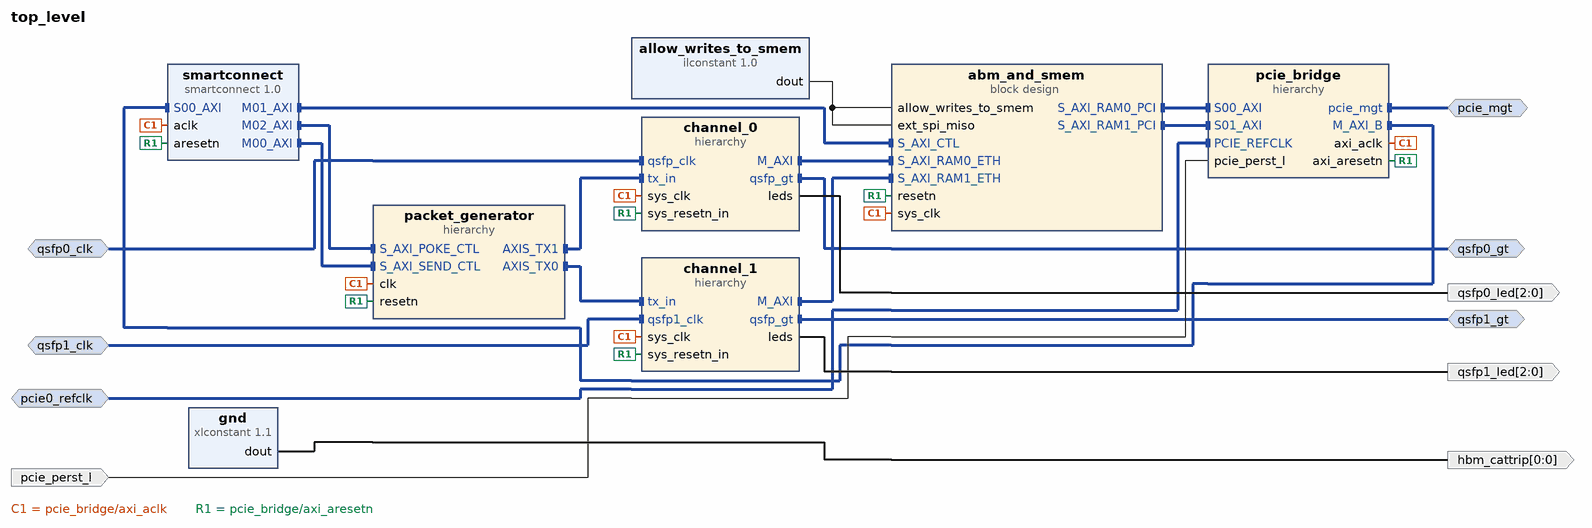
[diagram p0: block diagram of the top level]
# Vivado block design top_level, xcu55c-fsvh2892-2L-e, Vivado 2024.2
create_bd_design top_level

create_bd_intf_port -mode Slave -vlnv xilinx.com:interface:diff_clock_rtl:1.0 pcie0_refclk
create_bd_intf_port -mode Master -vlnv xilinx.com:interface:pcie_7x_mgt_rtl:1.0 pcie_mgt
create_bd_intf_port -mode Master -vlnv xilinx.com:interface:gt_rtl:1.0 qsfp0_gt
create_bd_intf_port -mode Slave -vlnv xilinx.com:interface:diff_clock_rtl:1.0 qsfp0_clk
set_property -dict {CONFIG.FREQ_HZ 161132812} [get_bd_intf_ports qsfp0_clk]
create_bd_intf_port -mode Master -vlnv xilinx.com:interface:gt_rtl:1.0 qsfp1_gt
create_bd_intf_port -mode Slave -vlnv xilinx.com:interface:diff_clock_rtl:1.0 qsfp1_clk
set_property -dict {CONFIG.FREQ_HZ 161132812} [get_bd_intf_ports qsfp1_clk]
create_bd_port -dir O -from 0 -to 0 hbm_cattrip
create_bd_port -dir I -type rst pcie_perst_l
create_bd_port -dir O -from 2 -to 0 qsfp1_led
create_bd_port -dir O -from 2 -to 0 qsfp0_led

create_bd_cell -type hier pcie_bridge
create_bd_cell -type ip -vlnv xilinx.com:ip:smartconnect:1.0 smartconnect
set_property -dict {CONFIG.NUM_MI 3 CONFIG.NUM_SI 1} [get_bd_cells smartconnect]
create_bd_cell -type ip -vlnv xilinx.com:ip:xlconstant:1.1 gnd
set_property -dict {CONFIG.CONST_VAL 0} [get_bd_cells gnd]
create_bd_cell -type hier channel_0
create_bd_cell -type hier channel_1
create_bd_cell -type hier packet_generator
create_bd_cell -type inline_hdl -vlnv xilinx.com:inline_hdl:ilconstant:1.0 allow_writes_to_smem
create_bd_cell -type container -reference abm_and_smem abm_and_smem
set_property -dict [list \
  CONFIG.ACTIVE_SIM_BD abm_and_smem.bd \
  CONFIG.ACTIVE_SYNTH_BD abm_and_smem.bd \
  CONFIG.ENABLE_DFX 0 \
  CONFIG.LIST_SIM_BD abm_and_smem.bd \
  CONFIG.LIST_SYNTH_BD abm_and_smem.bd \
  CONFIG.LOCK_PROPAGATE 0 \
] [get_bd_cells abm_and_smem]

# ---- hierarchy /pcie_bridge ----
current_bd_instance /pcie_bridge
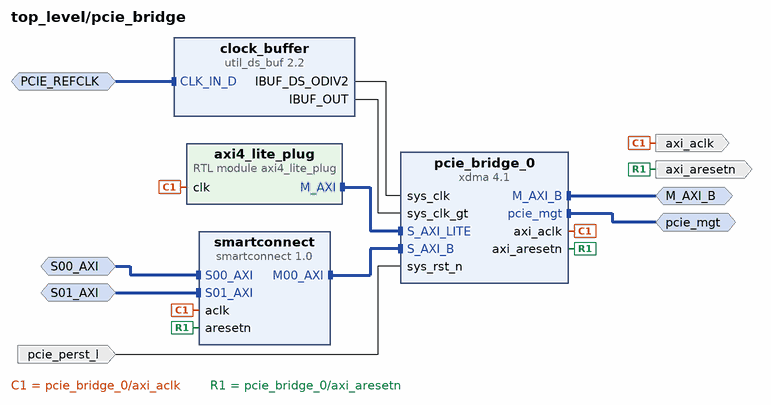
[diagram p1: block diagram inside /pcie_bridge]
create_bd_intf_pin -mode Slave -vlnv xilinx.com:interface:diff_clock_rtl:1.0 PCIE_REFCLK
create_bd_intf_pin -mode Slave -vlnv xilinx.com:interface:aximm_rtl:1.0 S00_AXI
create_bd_intf_pin -mode Slave -vlnv xilinx.com:interface:aximm_rtl:1.0 S01_AXI
create_bd_intf_pin -mode Master -vlnv xilinx.com:interface:pcie_7x_mgt_rtl:1.0 pcie_mgt
create_bd_intf_pin -mode Master -vlnv xilinx.com:interface:aximm_rtl:1.0 M_AXI_B
create_bd_pin -dir I -type rst pcie_perst_l
create_bd_pin -dir O -type clk axi_aclk
create_bd_pin -dir O -type rst axi_aresetn

create_bd_cell -type ip -vlnv xilinx.com:ip:util_ds_buf:2.2 clock_buffer
set_property -dict {CONFIG.C_BUF_TYPE IBUFDSGTE} [get_bd_cells clock_buffer]
create_bd_cell -type ip -vlnv xilinx.com:ip:smartconnect:1.0 smartconnect
set_property -dict {CONFIG.NUM_MI 1} [get_bd_cells smartconnect]
create_bd_cell -type module -reference axi4_lite_plug axi4_lite_plug
create_bd_cell -type ip -vlnv xilinx.com:ip:xdma:4.1 pcie_bridge_0
set_property -dict [list \
  CONFIG.PF0_DEVICE_ID_mqdma 9048 \
  CONFIG.PF0_SRIOV_VF_DEVICE_ID A048 \
  CONFIG.PF2_DEVICE_ID_mqdma 9248 \
  CONFIG.PF3_DEVICE_ID_mqdma 9348 \
  CONFIG.axi_addr_width 64 \
  CONFIG.axi_data_width 512_bit \
  CONFIG.axisten_freq 250 \
  CONFIG.bridge_burst true \
  CONFIG.en_axi_slave_if true \
  CONFIG.en_gt_selection false \
  CONFIG.functional_mode AXI_Bridge \
  CONFIG.mode_selection Advanced \
  CONFIG.pcie_blk_locn PCIE4C_X1Y0 \
  CONFIG.pf0_bar0_scale Megabytes \
  CONFIG.pf0_bar0_size 1 \
  CONFIG.pf0_device_id 903F \
  CONFIG.pf0_msi_enabled false \
  CONFIG.pl_link_cap_max_link_speed 16.0_GT/s \
  CONFIG.pl_link_cap_max_link_width X8 \
  CONFIG.runbit_fix false \
  CONFIG.xlnx_ref_board None \
] [get_bd_cells pcie_bridge_0]

# ---- hierarchy /channel_0 ----
current_bd_instance /channel_0
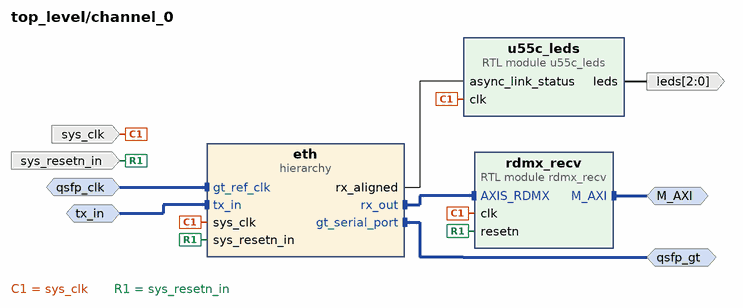
[diagram p2: block diagram inside /channel_0]
create_bd_intf_pin -mode Master -vlnv xilinx.com:interface:gt_rtl:1.0 qsfp_gt
create_bd_intf_pin -mode Slave -vlnv xilinx.com:interface:diff_clock_rtl:1.0 qsfp_clk
create_bd_intf_pin -mode Slave -vlnv xilinx.com:interface:axis_rtl:1.0 tx_in
create_bd_intf_pin -mode Master -vlnv xilinx.com:interface:aximm_rtl:1.0 M_AXI
create_bd_pin -dir I sys_clk
create_bd_pin -dir I sys_resetn_in
create_bd_pin -dir O -from 2 -to 0 leds

create_bd_cell -type hier eth
create_bd_cell -type module -reference u55c_leds u55c_leds
create_bd_cell -type module -reference rdmx_recv rdmx_recv

# ---- hierarchy /channel_0/eth ----
current_bd_instance /channel_0/eth
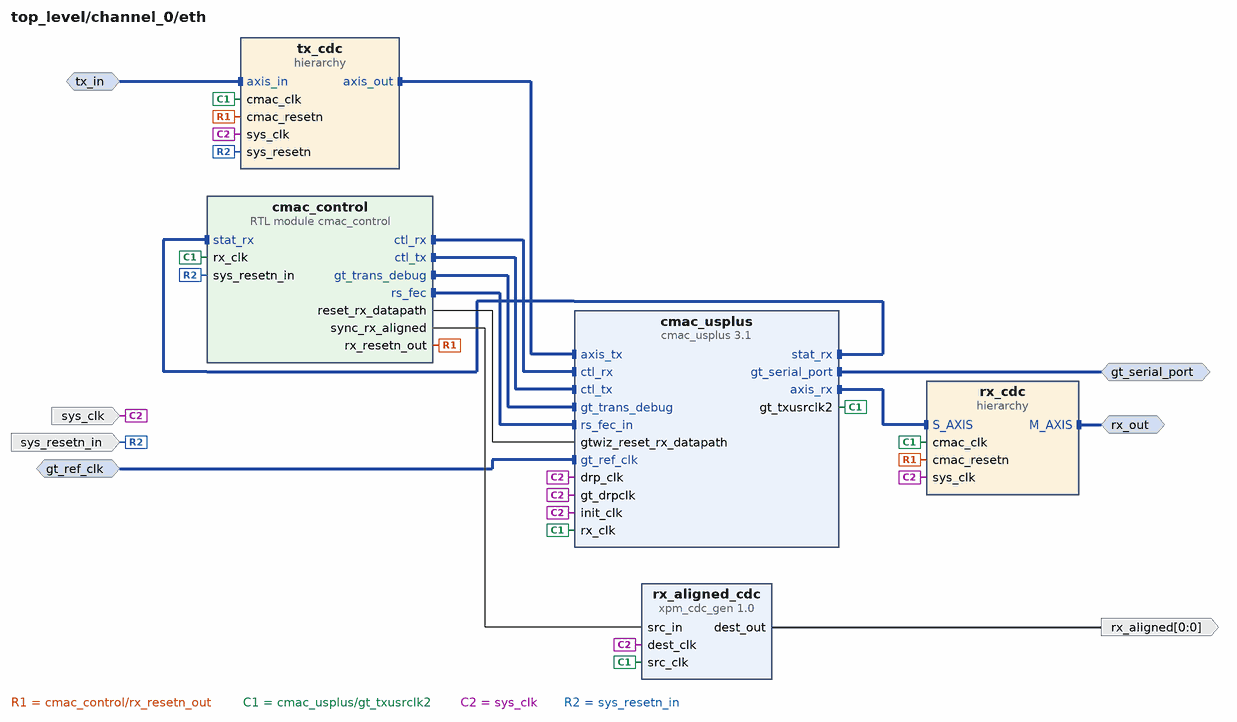
[diagram p3: block diagram inside /channel_0/eth]
create_bd_intf_pin -mode Master -vlnv xilinx.com:interface:gt_rtl:1.0 gt_serial_port
create_bd_intf_pin -mode Slave -vlnv xilinx.com:interface:diff_clock_rtl:1.0 gt_ref_clk
create_bd_intf_pin -mode Master -vlnv xilinx.com:interface:axis_rtl:1.0 rx_out
create_bd_intf_pin -mode Slave -vlnv xilinx.com:interface:axis_rtl:1.0 tx_in
create_bd_pin -dir I sys_resetn_in
create_bd_pin -dir I sys_clk
create_bd_pin -dir O -from 0 -to 0 rx_aligned

create_bd_cell -type ip -vlnv xilinx.com:ip:cmac_usplus:3.1 cmac_usplus
set_property -dict [list \
  CONFIG.ADD_GT_CNRL_STS_PORTS 1 \
  CONFIG.CMAC_CAUI4_MODE 1 \
  CONFIG.CMAC_CORE_SELECT CMACE4_X0Y3 \
  CONFIG.DIFFCLK_BOARD_INTERFACE Custom \
  CONFIG.ETHERNET_BOARD_INTERFACE Custom \
  CONFIG.GT_DRP_CLK 250 \
  CONFIG.GT_GROUP_SELECT {X0Y24~X0Y27} \
  CONFIG.GT_REF_CLK_FREQ 161.1328125 \
  CONFIG.INCLUDE_RS_FEC 1 \
  CONFIG.NUM_LANES 4x25 \
  CONFIG.RX_FLOW_CONTROL 0 \
  CONFIG.RX_GT_BUFFER 1 \
  CONFIG.TX_FLOW_CONTROL 0 \
  CONFIG.USER_INTERFACE AXIS \
] [get_bd_cells cmac_usplus]
create_bd_cell -type module -reference cmac_control cmac_control
create_bd_cell -type ip -vlnv xilinx.com:ip:xpm_cdc_gen:1.0 rx_aligned_cdc
set_property -dict [list \
  CONFIG.CDC_TYPE xpm_cdc_single \
  CONFIG.SIM_ASSERT_CHK false \
  CONFIG.SRC_INPUT_REG false \
  CONFIG.WIDTH 1 \
] [get_bd_cells rx_aligned_cdc]
create_bd_cell -type hier tx_cdc
create_bd_cell -type hier rx_cdc

# ---- hierarchy /channel_0/eth/tx_cdc ----
current_bd_instance /channel_0/eth/tx_cdc
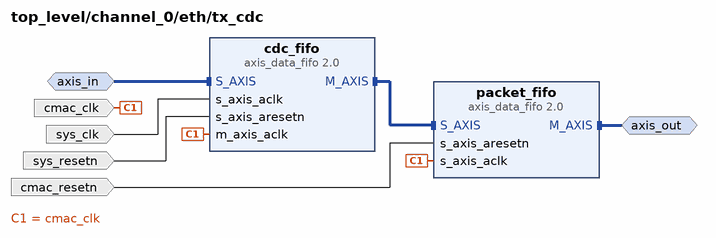
[diagram p4: block diagram inside /channel_0/eth/tx_cdc]
create_bd_intf_pin -mode Slave -vlnv xilinx.com:interface:axis_rtl:1.0 axis_in
create_bd_intf_pin -mode Master -vlnv xilinx.com:interface:axis_rtl:1.0 axis_out
create_bd_pin -dir I sys_clk
create_bd_pin -dir I sys_resetn
create_bd_pin -dir I cmac_clk
create_bd_pin -dir I cmac_resetn

create_bd_cell -type ip -vlnv xilinx.com:ip:axis_data_fifo:2.0 cdc_fifo
set_property -dict {CONFIG.FIFO_DEPTH 16 CONFIG.IS_ACLK_ASYNC 1} [get_bd_cells cdc_fifo]
create_bd_cell -type ip -vlnv xilinx.com:ip:axis_data_fifo:2.0 packet_fifo
set_property -dict {CONFIG.FIFO_MODE 2 CONFIG.IS_ACLK_ASYNC 0} [get_bd_cells packet_fifo]

# ---- hierarchy /channel_0/eth/rx_cdc ----
current_bd_instance /channel_0/eth/rx_cdc
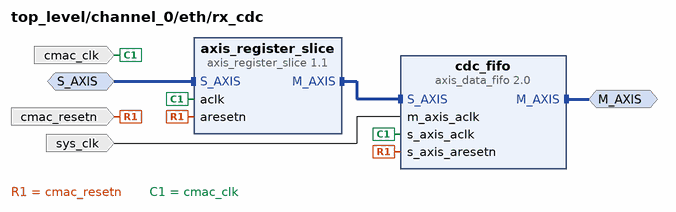
[diagram p5: block diagram inside /channel_0/eth/rx_cdc]
create_bd_intf_pin -mode Slave -vlnv xilinx.com:interface:axis_rtl:1.0 S_AXIS
create_bd_intf_pin -mode Master -vlnv xilinx.com:interface:axis_rtl:1.0 M_AXIS
create_bd_pin -dir I -type rst cmac_resetn
create_bd_pin -dir I -type clk cmac_clk
create_bd_pin -dir I sys_clk

create_bd_cell -type ip -vlnv xilinx.com:ip:axis_data_fifo:2.0 cdc_fifo
set_property -dict {CONFIG.FIFO_DEPTH 16 CONFIG.IS_ACLK_ASYNC 1} [get_bd_cells cdc_fifo]
create_bd_cell -type ip -vlnv xilinx.com:ip:axis_register_slice:1.1 axis_register_slice

# ---- hierarchy /channel_1 ----
current_bd_instance /channel_1
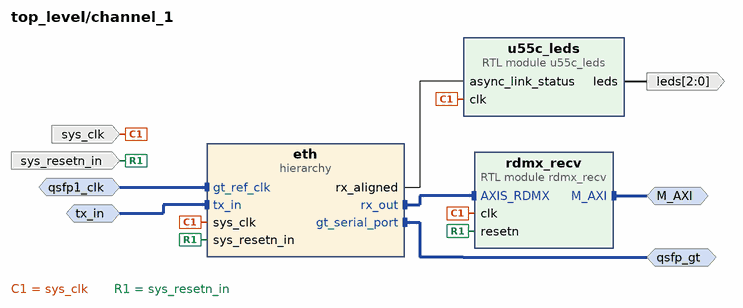
[diagram p6: block diagram inside /channel_1]
create_bd_intf_pin -mode Master -vlnv xilinx.com:interface:gt_rtl:1.0 qsfp_gt
create_bd_intf_pin -mode Slave -vlnv xilinx.com:interface:diff_clock_rtl:1.0 qsfp1_clk
create_bd_intf_pin -mode Slave -vlnv xilinx.com:interface:axis_rtl:1.0 tx_in
create_bd_intf_pin -mode Master -vlnv xilinx.com:interface:aximm_rtl:1.0 M_AXI
create_bd_pin -dir I sys_clk
create_bd_pin -dir I sys_resetn_in
create_bd_pin -dir O -from 2 -to 0 leds

create_bd_cell -type hier eth
create_bd_cell -type module -reference u55c_leds u55c_leds
create_bd_cell -type module -reference rdmx_recv rdmx_recv

# ---- hierarchy /channel_1/eth ----
current_bd_instance /channel_1/eth
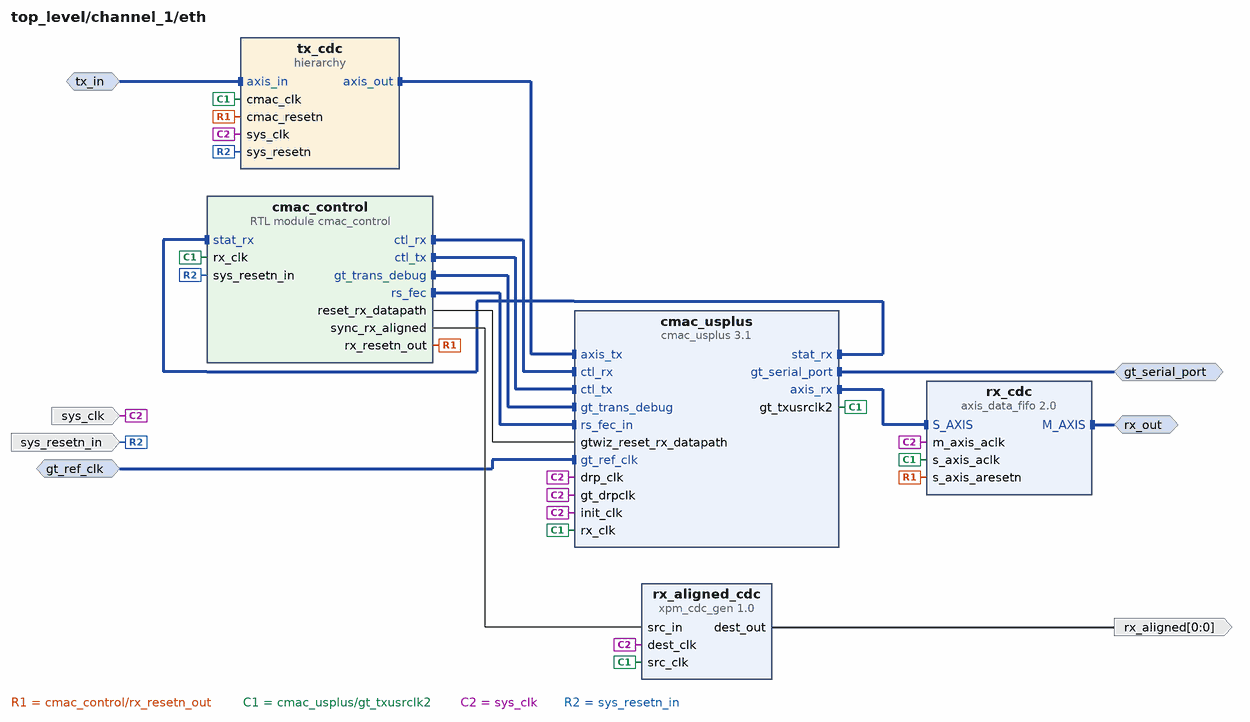
[diagram p7: block diagram inside /channel_1/eth]
create_bd_intf_pin -mode Master -vlnv xilinx.com:interface:gt_rtl:1.0 gt_serial_port
create_bd_intf_pin -mode Slave -vlnv xilinx.com:interface:diff_clock_rtl:1.0 gt_ref_clk
create_bd_intf_pin -mode Master -vlnv xilinx.com:interface:axis_rtl:1.0 rx_out
create_bd_intf_pin -mode Slave -vlnv xilinx.com:interface:axis_rtl:1.0 tx_in
create_bd_pin -dir I sys_resetn_in
create_bd_pin -dir I sys_clk
create_bd_pin -dir O -from 0 -to 0 rx_aligned

create_bd_cell -type ip -vlnv xilinx.com:ip:cmac_usplus:3.1 cmac_usplus
set_property -dict [list \
  CONFIG.ADD_GT_CNRL_STS_PORTS 1 \
  CONFIG.CMAC_CAUI4_MODE 1 \
  CONFIG.CMAC_CORE_SELECT CMACE4_X0Y4 \
  CONFIG.DIFFCLK_BOARD_INTERFACE Custom \
  CONFIG.ETHERNET_BOARD_INTERFACE Custom \
  CONFIG.GT_DRP_CLK 250 \
  CONFIG.GT_GROUP_SELECT {X0Y28~X0Y31} \
  CONFIG.GT_REF_CLK_FREQ 161.1328125 \
  CONFIG.INCLUDE_RS_FEC 1 \
  CONFIG.NUM_LANES 4x25 \
  CONFIG.RX_FLOW_CONTROL 0 \
  CONFIG.RX_GT_BUFFER 1 \
  CONFIG.TX_FLOW_CONTROL 0 \
  CONFIG.USER_INTERFACE AXIS \
] [get_bd_cells cmac_usplus]
create_bd_cell -type module -reference cmac_control cmac_control
create_bd_cell -type ip -vlnv xilinx.com:ip:axis_data_fifo:2.0 rx_cdc
set_property -dict {CONFIG.FIFO_DEPTH 16 CONFIG.IS_ACLK_ASYNC 1} [get_bd_cells rx_cdc]
create_bd_cell -type ip -vlnv xilinx.com:ip:xpm_cdc_gen:1.0 rx_aligned_cdc
set_property -dict [list \
  CONFIG.CDC_TYPE xpm_cdc_single \
  CONFIG.SIM_ASSERT_CHK false \
  CONFIG.SRC_INPUT_REG false \
  CONFIG.WIDTH 1 \
] [get_bd_cells rx_aligned_cdc]
create_bd_cell -type hier tx_cdc

# ---- hierarchy /channel_1/eth/tx_cdc ----
current_bd_instance /channel_1/eth/tx_cdc
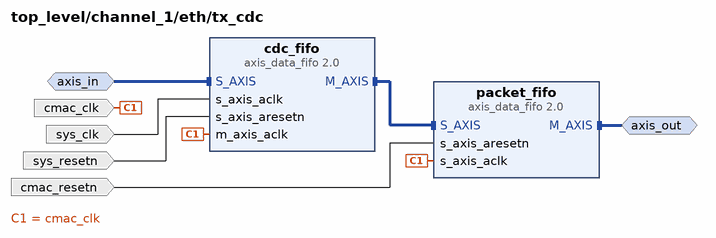
[diagram p8: block diagram inside /channel_1/eth/tx_cdc]
create_bd_intf_pin -mode Slave -vlnv xilinx.com:interface:axis_rtl:1.0 axis_in
create_bd_intf_pin -mode Master -vlnv xilinx.com:interface:axis_rtl:1.0 axis_out
create_bd_pin -dir I sys_clk
create_bd_pin -dir I sys_resetn
create_bd_pin -dir I cmac_clk
create_bd_pin -dir I cmac_resetn

create_bd_cell -type ip -vlnv xilinx.com:ip:axis_data_fifo:2.0 cdc_fifo
set_property -dict {CONFIG.FIFO_DEPTH 16 CONFIG.IS_ACLK_ASYNC 1} [get_bd_cells cdc_fifo]
create_bd_cell -type ip -vlnv xilinx.com:ip:axis_data_fifo:2.0 packet_fifo
set_property -dict {CONFIG.FIFO_MODE 2 CONFIG.IS_ACLK_ASYNC 0} [get_bd_cells packet_fifo]

# ---- hierarchy /packet_generator ----
current_bd_instance /packet_generator
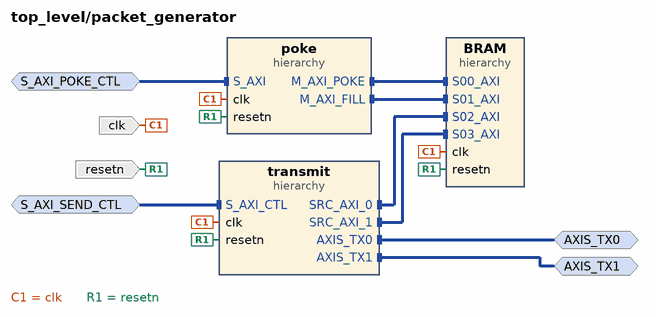
[diagram p9: block diagram inside /packet_generator]
create_bd_intf_pin -mode Slave -vlnv xilinx.com:interface:aximm_rtl:1.0 S_AXI_POKE_CTL
create_bd_intf_pin -mode Slave -vlnv xilinx.com:interface:aximm_rtl:1.0 S_AXI_SEND_CTL
create_bd_intf_pin -mode Master -vlnv xilinx.com:interface:axis_rtl:1.0 AXIS_TX0
create_bd_intf_pin -mode Master -vlnv xilinx.com:interface:axis_rtl:1.0 AXIS_TX1
create_bd_pin -dir I clk
create_bd_pin -dir I resetn

create_bd_cell -type hier poke
create_bd_cell -type hier transmit
create_bd_cell -type hier BRAM

# ---- hierarchy /packet_generator/poke ----
current_bd_instance /packet_generator/poke
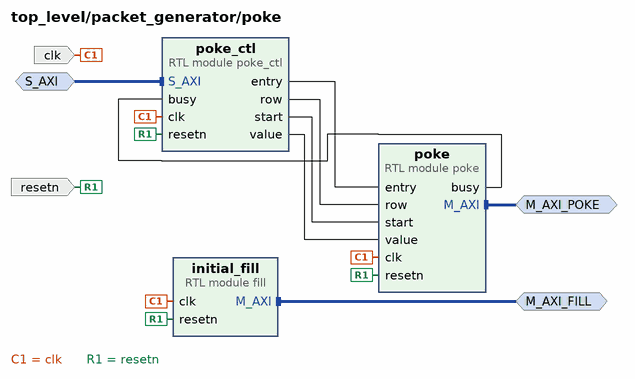
[diagram p10: block diagram inside /packet_generator/poke]
create_bd_intf_pin -mode Slave -vlnv xilinx.com:interface:aximm_rtl:1.0 S_AXI
create_bd_intf_pin -mode Master -vlnv xilinx.com:interface:aximm_rtl:1.0 M_AXI_POKE
create_bd_intf_pin -mode Master -vlnv xilinx.com:interface:aximm_rtl:1.0 M_AXI_FILL
create_bd_pin -dir I clk
create_bd_pin -dir I resetn

create_bd_cell -type module -reference poke_ctl poke_ctl
create_bd_cell -type module -reference poke poke
create_bd_cell -type module -reference fill initial_fill

# ---- hierarchy /packet_generator/transmit ----
current_bd_instance /packet_generator/transmit
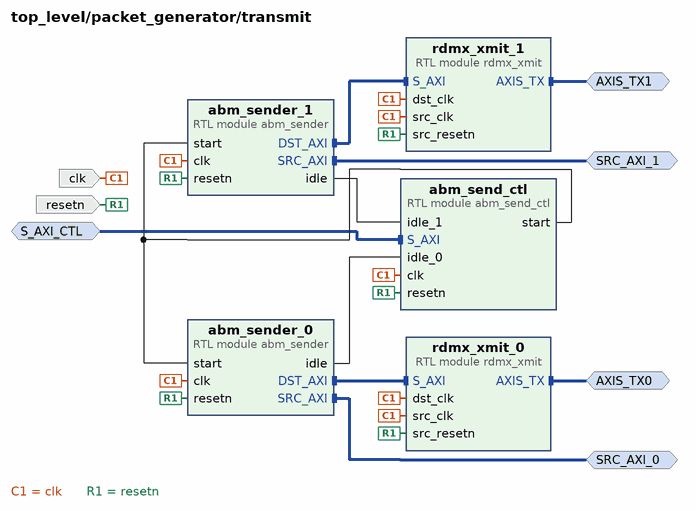
[diagram p11: block diagram inside /packet_generator/transmit]
create_bd_intf_pin -mode Master -vlnv xilinx.com:interface:aximm_rtl:1.0 SRC_AXI_0
create_bd_intf_pin -mode Master -vlnv xilinx.com:interface:axis_rtl:1.0 AXIS_TX0
create_bd_intf_pin -mode Master -vlnv xilinx.com:interface:axis_rtl:1.0 AXIS_TX1
create_bd_intf_pin -mode Master -vlnv xilinx.com:interface:aximm_rtl:1.0 SRC_AXI_1
create_bd_intf_pin -mode Slave -vlnv xilinx.com:interface:aximm_rtl:1.0 S_AXI_CTL
create_bd_pin -dir I clk
create_bd_pin -dir I resetn

create_bd_cell -type module -reference abm_sender abm_sender_0
create_bd_cell -type module -reference rdmx_xmit rdmx_xmit_0
set_property -dict {CONFIG.FIFO_CLOCK_MODE common_clk CONFIG.SRC_MAC 0} [get_bd_cells rdmx_xmit_0]
create_bd_cell -type module -reference rdmx_xmit rdmx_xmit_1
set_property -dict {CONFIG.FIFO_CLOCK_MODE common_clk CONFIG.SRC_MAC 1} [get_bd_cells rdmx_xmit_1]
create_bd_cell -type module -reference abm_sender abm_sender_1
create_bd_cell -type module -reference abm_send_ctl abm_send_ctl

# ---- hierarchy /packet_generator/BRAM ----
current_bd_instance /packet_generator/BRAM
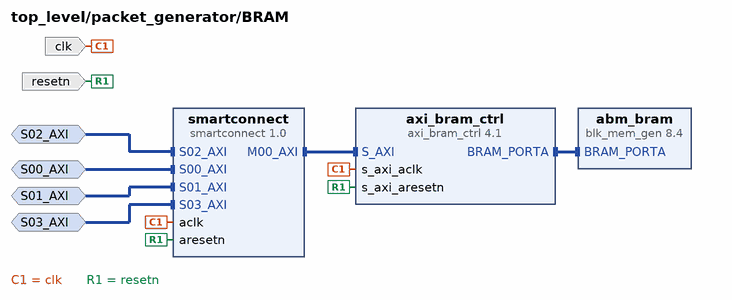
[diagram p12: block diagram inside /packet_generator/BRAM]
create_bd_intf_pin -mode Slave -vlnv xilinx.com:interface:aximm_rtl:1.0 S00_AXI
create_bd_intf_pin -mode Slave -vlnv xilinx.com:interface:aximm_rtl:1.0 S01_AXI
create_bd_intf_pin -mode Slave -vlnv xilinx.com:interface:aximm_rtl:1.0 S02_AXI
create_bd_intf_pin -mode Slave -vlnv xilinx.com:interface:aximm_rtl:1.0 S03_AXI
create_bd_pin -dir I clk
create_bd_pin -dir I resetn

create_bd_cell -type ip -vlnv xilinx.com:ip:smartconnect:1.0 smartconnect
set_property -dict {CONFIG.NUM_SI 4} [get_bd_cells smartconnect]
create_bd_cell -type ip -vlnv xilinx.com:ip:axi_bram_ctrl:4.1 axi_bram_ctrl
set_property -dict {CONFIG.DATA_WIDTH 512 CONFIG.SINGLE_PORT_BRAM 1 CONFIG.SUPPORTS_NARROW_BURST 0} [get_bd_cells axi_bram_ctrl]
create_bd_cell -type ip -vlnv xilinx.com:ip:blk_mem_gen:8.4 abm_bram
set_property -dict {CONFIG.PRIM_type_to_Implement URAM} [get_bd_cells abm_bram]

# ---- connections ----

current_bd_instance /pcie_bridge
connect_bd_intf_net [get_bd_intf_pins PCIE_REFCLK] [get_bd_intf_pins clock_buffer/CLK_IN_D]
connect_bd_intf_net [get_bd_intf_pins pcie_bridge_0/pcie_mgt] [get_bd_intf_pins pcie_mgt]
connect_bd_intf_net [get_bd_intf_pins pcie_bridge_0/M_AXI_B] [get_bd_intf_pins M_AXI_B]
connect_bd_intf_net [get_bd_intf_pins S00_AXI] [get_bd_intf_pins smartconnect/S00_AXI]
connect_bd_intf_net [get_bd_intf_pins S01_AXI] [get_bd_intf_pins smartconnect/S01_AXI]
connect_bd_intf_net [get_bd_intf_pins axi4_lite_plug/M_AXI] [get_bd_intf_pins pcie_bridge_0/S_AXI_LITE]
connect_bd_intf_net [get_bd_intf_pins smartconnect/M00_AXI] [get_bd_intf_pins pcie_bridge_0/S_AXI_B]
connect_bd_net [get_bd_pins clock_buffer/IBUF_DS_ODIV2] [get_bd_pins pcie_bridge_0/sys_clk]
connect_bd_net [get_bd_pins clock_buffer/IBUF_OUT] [get_bd_pins pcie_bridge_0/sys_clk_gt]
connect_bd_net [get_bd_pins pcie_bridge_0/axi_aclk] [get_bd_pins axi_aclk] [get_bd_pins smartconnect/aclk] [get_bd_pins axi4_lite_plug/clk]
connect_bd_net [get_bd_pins pcie_bridge_0/axi_aresetn] [get_bd_pins axi_aresetn] [get_bd_pins smartconnect/aresetn]
connect_bd_net [get_bd_pins pcie_perst_l] [get_bd_pins pcie_bridge_0/sys_rst_n]

current_bd_instance /channel_0
connect_bd_intf_net [get_bd_intf_pins qsfp_gt] [get_bd_intf_pins eth/gt_serial_port]
connect_bd_intf_net [get_bd_intf_pins eth/rx_out] [get_bd_intf_pins rdmx_recv/AXIS_RDMX]
connect_bd_intf_net [get_bd_intf_pins qsfp_clk] [get_bd_intf_pins eth/gt_ref_clk]
connect_bd_intf_net [get_bd_intf_pins M_AXI] [get_bd_intf_pins rdmx_recv/M_AXI]
connect_bd_intf_net [get_bd_intf_pins tx_in] [get_bd_intf_pins eth/tx_in]
connect_bd_net [get_bd_pins eth/rx_aligned] [get_bd_pins u55c_leds/async_link_status]
connect_bd_net -net pcie_bridge_0_axi_aclk [get_bd_pins sys_clk] [get_bd_pins eth/sys_clk] [get_bd_pins u55c_leds/clk] [get_bd_pins rdmx_recv/clk]
connect_bd_net -net pcie_bridge_0_axi_aresetn [get_bd_pins sys_resetn_in] [get_bd_pins eth/sys_resetn_in] [get_bd_pins rdmx_recv/resetn]
connect_bd_net -net u55c_leds_0_leds [get_bd_pins u55c_leds/leds] [get_bd_pins leds]

current_bd_instance /channel_0/eth
connect_bd_intf_net [get_bd_intf_pins rx_out] [get_bd_intf_pins rx_cdc/M_AXIS]
connect_bd_intf_net [get_bd_intf_pins cmac_control/ctl_rx] [get_bd_intf_pins cmac_usplus/ctl_rx]
connect_bd_intf_net [get_bd_intf_pins cmac_control/ctl_tx] [get_bd_intf_pins cmac_usplus/ctl_tx]
connect_bd_intf_net [get_bd_intf_pins cmac_control/gt_trans_debug] [get_bd_intf_pins cmac_usplus/gt_trans_debug]
connect_bd_intf_net [get_bd_intf_pins cmac_control/rs_fec] [get_bd_intf_pins cmac_usplus/rs_fec_in]
connect_bd_intf_net [get_bd_intf_pins cmac_usplus/axis_rx] [get_bd_intf_pins rx_cdc/S_AXIS]
connect_bd_intf_net [get_bd_intf_pins gt_serial_port] [get_bd_intf_pins cmac_usplus/gt_serial_port]
connect_bd_intf_net [get_bd_intf_pins cmac_control/stat_rx] [get_bd_intf_pins cmac_usplus/stat_rx]
connect_bd_intf_net [get_bd_intf_pins gt_ref_clk] [get_bd_intf_pins cmac_usplus/gt_ref_clk]
connect_bd_intf_net [get_bd_intf_pins tx_cdc/axis_out] [get_bd_intf_pins cmac_usplus/axis_tx]
connect_bd_intf_net [get_bd_intf_pins tx_in] [get_bd_intf_pins tx_cdc/axis_in]
connect_bd_net [get_bd_pins cmac_control/reset_rx_datapath] [get_bd_pins cmac_usplus/gtwiz_reset_rx_datapath]
connect_bd_net [get_bd_pins cmac_control/rx_resetn_out] [get_bd_pins tx_cdc/cmac_resetn] [get_bd_pins rx_cdc/cmac_resetn]
connect_bd_net [get_bd_pins cmac_control/sync_rx_aligned] [get_bd_pins rx_aligned_cdc/src_in]
connect_bd_net [get_bd_pins cmac_usplus/gt_txusrclk2] \
  [get_bd_pins cmac_control/rx_clk] [get_bd_pins tx_cdc/cmac_clk] [get_bd_pins rx_cdc/cmac_clk] \
  [get_bd_pins cmac_usplus/rx_clk] [get_bd_pins rx_aligned_cdc/src_clk]
connect_bd_net [get_bd_pins rx_aligned_cdc/dest_out] [get_bd_pins rx_aligned]
connect_bd_net [get_bd_pins sys_clk] \
  [get_bd_pins tx_cdc/sys_clk] [get_bd_pins rx_cdc/sys_clk] [get_bd_pins cmac_usplus/gt_drpclk] \
  [get_bd_pins cmac_usplus/init_clk] [get_bd_pins cmac_usplus/drp_clk] [get_bd_pins rx_aligned_cdc/dest_clk]
connect_bd_net [get_bd_pins sys_resetn_in] [get_bd_pins cmac_control/sys_resetn_in] [get_bd_pins tx_cdc/sys_resetn]

current_bd_instance /channel_0/eth/tx_cdc
connect_bd_intf_net [get_bd_intf_pins axis_in] [get_bd_intf_pins cdc_fifo/S_AXIS]
connect_bd_intf_net [get_bd_intf_pins cdc_fifo/M_AXIS] [get_bd_intf_pins packet_fifo/S_AXIS]
connect_bd_intf_net [get_bd_intf_pins axis_out] [get_bd_intf_pins packet_fifo/M_AXIS]
connect_bd_net [get_bd_pins cmac_clk] [get_bd_pins cdc_fifo/m_axis_aclk] [get_bd_pins packet_fifo/s_axis_aclk]
connect_bd_net [get_bd_pins cmac_resetn] [get_bd_pins packet_fifo/s_axis_aresetn]
connect_bd_net [get_bd_pins sys_clk] [get_bd_pins cdc_fifo/s_axis_aclk]
connect_bd_net [get_bd_pins sys_resetn] [get_bd_pins cdc_fifo/s_axis_aresetn]

current_bd_instance /channel_0/eth/rx_cdc
connect_bd_intf_net [get_bd_intf_pins S_AXIS] [get_bd_intf_pins axis_register_slice/S_AXIS]
connect_bd_intf_net [get_bd_intf_pins M_AXIS] [get_bd_intf_pins cdc_fifo/M_AXIS]
connect_bd_intf_net [get_bd_intf_pins axis_register_slice/M_AXIS] [get_bd_intf_pins cdc_fifo/S_AXIS]
connect_bd_net -net cmac_control_rx_resetn_out [get_bd_pins cmac_resetn] \
  [get_bd_pins cdc_fifo/s_axis_aresetn] [get_bd_pins axis_register_slice/aresetn]
connect_bd_net -net cmac_usplus_gt_txusrclk2 [get_bd_pins cmac_clk] [get_bd_pins cdc_fifo/s_axis_aclk] [get_bd_pins axis_register_slice/aclk]
connect_bd_net [get_bd_pins sys_clk] [get_bd_pins cdc_fifo/m_axis_aclk]

current_bd_instance /channel_1
connect_bd_intf_net [get_bd_intf_pins qsfp_gt] [get_bd_intf_pins eth/gt_serial_port]
connect_bd_intf_net [get_bd_intf_pins rdmx_recv/AXIS_RDMX] [get_bd_intf_pins eth/rx_out]
connect_bd_intf_net [get_bd_intf_pins qsfp1_clk] [get_bd_intf_pins eth/gt_ref_clk]
connect_bd_intf_net [get_bd_intf_pins M_AXI] [get_bd_intf_pins rdmx_recv/M_AXI]
connect_bd_intf_net [get_bd_intf_pins tx_in] [get_bd_intf_pins eth/tx_in]
connect_bd_net [get_bd_pins eth/rx_aligned] [get_bd_pins u55c_leds/async_link_status]
connect_bd_net -net pcie_bridge_0_axi_aclk [get_bd_pins sys_clk] [get_bd_pins eth/sys_clk] [get_bd_pins u55c_leds/clk] [get_bd_pins rdmx_recv/clk]
connect_bd_net -net pcie_bridge_0_axi_aresetn [get_bd_pins sys_resetn_in] [get_bd_pins eth/sys_resetn_in] [get_bd_pins rdmx_recv/resetn]
connect_bd_net -net u55c_leds_0_leds [get_bd_pins u55c_leds/leds] [get_bd_pins leds]

current_bd_instance /channel_1/eth
connect_bd_intf_net [get_bd_intf_pins rx_out] [get_bd_intf_pins rx_cdc/M_AXIS]
connect_bd_intf_net [get_bd_intf_pins cmac_control/ctl_rx] [get_bd_intf_pins cmac_usplus/ctl_rx]
connect_bd_intf_net [get_bd_intf_pins cmac_control/ctl_tx] [get_bd_intf_pins cmac_usplus/ctl_tx]
connect_bd_intf_net [get_bd_intf_pins cmac_control/gt_trans_debug] [get_bd_intf_pins cmac_usplus/gt_trans_debug]
connect_bd_intf_net [get_bd_intf_pins cmac_control/rs_fec] [get_bd_intf_pins cmac_usplus/rs_fec_in]
connect_bd_intf_net [get_bd_intf_pins cmac_usplus/axis_rx] [get_bd_intf_pins rx_cdc/S_AXIS]
connect_bd_intf_net [get_bd_intf_pins gt_serial_port] [get_bd_intf_pins cmac_usplus/gt_serial_port]
connect_bd_intf_net [get_bd_intf_pins cmac_control/stat_rx] [get_bd_intf_pins cmac_usplus/stat_rx]
connect_bd_intf_net [get_bd_intf_pins gt_ref_clk] [get_bd_intf_pins cmac_usplus/gt_ref_clk]
connect_bd_intf_net [get_bd_intf_pins tx_cdc/axis_out] [get_bd_intf_pins cmac_usplus/axis_tx]
connect_bd_intf_net [get_bd_intf_pins tx_in] [get_bd_intf_pins tx_cdc/axis_in]
connect_bd_net [get_bd_pins cmac_control/reset_rx_datapath] [get_bd_pins cmac_usplus/gtwiz_reset_rx_datapath]
connect_bd_net [get_bd_pins cmac_control/rx_resetn_out] [get_bd_pins tx_cdc/cmac_resetn] [get_bd_pins rx_cdc/s_axis_aresetn]
connect_bd_net [get_bd_pins cmac_control/sync_rx_aligned] [get_bd_pins rx_aligned_cdc/src_in]
connect_bd_net [get_bd_pins cmac_usplus/gt_txusrclk2] \
  [get_bd_pins cmac_control/rx_clk] [get_bd_pins tx_cdc/cmac_clk] [get_bd_pins cmac_usplus/rx_clk] \
  [get_bd_pins rx_aligned_cdc/src_clk] [get_bd_pins rx_cdc/s_axis_aclk]
connect_bd_net [get_bd_pins rx_aligned_cdc/dest_out] [get_bd_pins rx_aligned]
connect_bd_net [get_bd_pins sys_clk] \
  [get_bd_pins tx_cdc/sys_clk] [get_bd_pins cmac_usplus/gt_drpclk] [get_bd_pins cmac_usplus/init_clk] \
  [get_bd_pins cmac_usplus/drp_clk] [get_bd_pins rx_aligned_cdc/dest_clk] [get_bd_pins rx_cdc/m_axis_aclk]
connect_bd_net [get_bd_pins sys_resetn_in] [get_bd_pins cmac_control/sys_resetn_in] [get_bd_pins tx_cdc/sys_resetn]

current_bd_instance /channel_1/eth/tx_cdc
connect_bd_intf_net [get_bd_intf_pins axis_in] [get_bd_intf_pins cdc_fifo/S_AXIS]
connect_bd_intf_net [get_bd_intf_pins cdc_fifo/M_AXIS] [get_bd_intf_pins packet_fifo/S_AXIS]
connect_bd_intf_net [get_bd_intf_pins axis_out] [get_bd_intf_pins packet_fifo/M_AXIS]
connect_bd_net [get_bd_pins cmac_clk] [get_bd_pins cdc_fifo/m_axis_aclk] [get_bd_pins packet_fifo/s_axis_aclk]
connect_bd_net [get_bd_pins cmac_resetn] [get_bd_pins packet_fifo/s_axis_aresetn]
connect_bd_net [get_bd_pins sys_clk] [get_bd_pins cdc_fifo/s_axis_aclk]
connect_bd_net [get_bd_pins sys_resetn] [get_bd_pins cdc_fifo/s_axis_aresetn]

current_bd_instance /packet_generator
connect_bd_intf_net [get_bd_intf_pins S_AXI_POKE_CTL] [get_bd_intf_pins poke/S_AXI]
connect_bd_intf_net [get_bd_intf_pins S_AXI_SEND_CTL] [get_bd_intf_pins transmit/S_AXI_CTL]
connect_bd_intf_net [get_bd_intf_pins transmit/SRC_AXI_0] [get_bd_intf_pins BRAM/S02_AXI]
connect_bd_intf_net [get_bd_intf_pins poke/M_AXI_POKE] [get_bd_intf_pins BRAM/S00_AXI]
connect_bd_intf_net [get_bd_intf_pins BRAM/S01_AXI] [get_bd_intf_pins poke/M_AXI_FILL]
connect_bd_intf_net [get_bd_intf_pins AXIS_TX0] [get_bd_intf_pins transmit/AXIS_TX0]
connect_bd_intf_net [get_bd_intf_pins AXIS_TX1] [get_bd_intf_pins transmit/AXIS_TX1]
connect_bd_intf_net [get_bd_intf_pins transmit/SRC_AXI_1] [get_bd_intf_pins BRAM/S03_AXI]
connect_bd_net -net s_axi_aclk_1 [get_bd_pins clk] [get_bd_pins poke/clk] [get_bd_pins transmit/clk] [get_bd_pins BRAM/clk]
connect_bd_net -net s_axi_aresetn_1 [get_bd_pins resetn] [get_bd_pins poke/resetn] [get_bd_pins transmit/resetn] [get_bd_pins BRAM/resetn]

current_bd_instance /packet_generator/poke
connect_bd_intf_net [get_bd_intf_pins initial_fill/M_AXI] [get_bd_intf_pins M_AXI_FILL]
connect_bd_intf_net [get_bd_intf_pins S_AXI] [get_bd_intf_pins poke_ctl/S_AXI]
connect_bd_intf_net [get_bd_intf_pins M_AXI_POKE] [get_bd_intf_pins poke/M_AXI]
connect_bd_net [get_bd_pins poke/busy] [get_bd_pins poke_ctl/busy]
connect_bd_net -net poke_ctl_0_entry [get_bd_pins poke_ctl/entry] [get_bd_pins poke/entry]
connect_bd_net -net poke_ctl_0_row [get_bd_pins poke_ctl/row] [get_bd_pins poke/row]
connect_bd_net -net poke_ctl_0_start [get_bd_pins poke_ctl/start] [get_bd_pins poke/start]
connect_bd_net -net poke_ctl_0_value [get_bd_pins poke_ctl/value] [get_bd_pins poke/value]
connect_bd_net -net s_axi_aclk_1 [get_bd_pins clk] [get_bd_pins poke/clk] [get_bd_pins poke_ctl/clk] [get_bd_pins initial_fill/clk]
connect_bd_net -net s_axi_aresetn_1 [get_bd_pins resetn] [get_bd_pins poke/resetn] [get_bd_pins poke_ctl/resetn] [get_bd_pins initial_fill/resetn]

current_bd_instance /packet_generator/transmit
connect_bd_intf_net [get_bd_intf_pins S_AXI_CTL] [get_bd_intf_pins abm_send_ctl/S_AXI]
connect_bd_intf_net [get_bd_intf_pins rdmx_xmit_0/S_AXI] [get_bd_intf_pins abm_sender_0/DST_AXI]
connect_bd_intf_net [get_bd_intf_pins SRC_AXI_0] [get_bd_intf_pins abm_sender_0/SRC_AXI]
connect_bd_intf_net [get_bd_intf_pins abm_sender_1/DST_AXI] [get_bd_intf_pins rdmx_xmit_1/S_AXI]
connect_bd_intf_net [get_bd_intf_pins SRC_AXI_1] [get_bd_intf_pins abm_sender_1/SRC_AXI]
connect_bd_intf_net [get_bd_intf_pins AXIS_TX0] [get_bd_intf_pins rdmx_xmit_0/AXIS_TX]
connect_bd_intf_net [get_bd_intf_pins AXIS_TX1] [get_bd_intf_pins rdmx_xmit_1/AXIS_TX]
connect_bd_net [get_bd_pins abm_send_ctl/start] [get_bd_pins abm_sender_1/start] [get_bd_pins abm_sender_0/start]
connect_bd_net [get_bd_pins abm_sender_0/idle] [get_bd_pins abm_send_ctl/idle_0]
connect_bd_net [get_bd_pins abm_sender_1/idle] [get_bd_pins abm_send_ctl/idle_1]
connect_bd_net [get_bd_pins clk] \
  [get_bd_pins abm_sender_0/clk] [get_bd_pins rdmx_xmit_0/src_clk] [get_bd_pins rdmx_xmit_0/dst_clk] \
  [get_bd_pins rdmx_xmit_1/src_clk] [get_bd_pins rdmx_xmit_1/dst_clk] [get_bd_pins abm_sender_1/clk] \
  [get_bd_pins abm_send_ctl/clk]
connect_bd_net [get_bd_pins resetn] \
  [get_bd_pins abm_sender_0/resetn] [get_bd_pins rdmx_xmit_0/src_resetn] [get_bd_pins rdmx_xmit_1/src_resetn] \
  [get_bd_pins abm_sender_1/resetn] [get_bd_pins abm_send_ctl/resetn]

current_bd_instance /packet_generator/BRAM
connect_bd_intf_net [get_bd_intf_pins S02_AXI] [get_bd_intf_pins smartconnect/S02_AXI]
connect_bd_intf_net [get_bd_intf_pins abm_bram/BRAM_PORTA] [get_bd_intf_pins axi_bram_ctrl/BRAM_PORTA]
connect_bd_intf_net [get_bd_intf_pins S00_AXI] [get_bd_intf_pins smartconnect/S00_AXI]
connect_bd_intf_net [get_bd_intf_pins S01_AXI] [get_bd_intf_pins smartconnect/S01_AXI]
connect_bd_intf_net [get_bd_intf_pins smartconnect/M00_AXI] [get_bd_intf_pins axi_bram_ctrl/S_AXI]
connect_bd_intf_net [get_bd_intf_pins S03_AXI] [get_bd_intf_pins smartconnect/S03_AXI]
connect_bd_net -net s_axi_aclk_1 [get_bd_pins clk] [get_bd_pins axi_bram_ctrl/s_axi_aclk] [get_bd_pins smartconnect/aclk]
connect_bd_net -net s_axi_aresetn_1 [get_bd_pins resetn] [get_bd_pins axi_bram_ctrl/s_axi_aresetn] [get_bd_pins smartconnect/aresetn]

current_bd_instance /
connect_bd_intf_net [get_bd_intf_ports pcie0_refclk] [get_bd_intf_pins pcie_bridge/PCIE_REFCLK]
connect_bd_intf_net [get_bd_intf_pins abm_and_smem/S_AXI_CTL] [get_bd_intf_pins smartconnect/M01_AXI]
connect_bd_intf_net [get_bd_intf_pins packet_generator/S_AXI_POKE_CTL] [get_bd_intf_pins smartconnect/M02_AXI]
connect_bd_intf_net [get_bd_intf_pins packet_generator/S_AXI_SEND_CTL] [get_bd_intf_pins smartconnect/M00_AXI]
connect_bd_intf_net [get_bd_intf_pins channel_0/M_AXI] [get_bd_intf_pins abm_and_smem/S_AXI_RAM0_ETH]
connect_bd_intf_net [get_bd_intf_pins channel_1/M_AXI] [get_bd_intf_pins abm_and_smem/S_AXI_RAM1_ETH]
connect_bd_intf_net [get_bd_intf_ports qsfp1_gt] [get_bd_intf_pins channel_1/qsfp_gt]
connect_bd_intf_net [get_bd_intf_ports qsfp0_gt] [get_bd_intf_pins channel_0/qsfp_gt]
connect_bd_intf_net [get_bd_intf_ports qsfp0_clk] [get_bd_intf_pins channel_0/qsfp_clk]
connect_bd_intf_net [get_bd_intf_pins packet_generator/AXIS_TX0] [get_bd_intf_pins channel_1/tx_in]
connect_bd_intf_net [get_bd_intf_pins packet_generator/AXIS_TX1] [get_bd_intf_pins channel_0/tx_in]
connect_bd_intf_net [get_bd_intf_pins smartconnect/S00_AXI] [get_bd_intf_pins pcie_bridge/M_AXI_B]
connect_bd_intf_net [get_bd_intf_ports pcie_mgt] [get_bd_intf_pins pcie_bridge/pcie_mgt]
connect_bd_intf_net [get_bd_intf_ports qsfp1_clk] [get_bd_intf_pins channel_1/qsfp1_clk]
connect_bd_intf_net [get_bd_intf_pins abm_and_smem/S_AXI_RAM0_PCI] [get_bd_intf_pins pcie_bridge/S00_AXI]
connect_bd_intf_net [get_bd_intf_pins abm_and_smem/S_AXI_RAM1_PCI] [get_bd_intf_pins pcie_bridge/S01_AXI]
connect_bd_net [get_bd_pins allow_writes_to_smem/dout] [get_bd_pins abm_and_smem/allow_writes_to_smem] [get_bd_pins abm_and_smem/ext_spi_miso]
connect_bd_net [get_bd_pins channel_0/leds] [get_bd_ports qsfp0_led]
connect_bd_net [get_bd_pins channel_1/leds] [get_bd_ports qsfp1_led]
connect_bd_net [get_bd_pins gnd/dout] [get_bd_ports hbm_cattrip]
connect_bd_net -net pcie_bridge_0_axi_aclk [get_bd_pins pcie_bridge/axi_aclk] \
  [get_bd_pins channel_0/sys_clk] [get_bd_pins channel_1/sys_clk] [get_bd_pins smartconnect/aclk] \
  [get_bd_pins packet_generator/clk] [get_bd_pins abm_and_smem/sys_clk]
connect_bd_net -net pcie_bridge_0_axi_aresetn [get_bd_pins pcie_bridge/axi_aresetn] \
  [get_bd_pins channel_0/sys_resetn_in] [get_bd_pins channel_1/sys_resetn_in] [get_bd_pins smartconnect/aresetn] \
  [get_bd_pins packet_generator/resetn] [get_bd_pins abm_and_smem/resetn]
connect_bd_net [get_bd_ports pcie_perst_l] [get_bd_pins pcie_bridge/pcie_perst_l]

# ---- address map ----
assign_bd_address -offset 0x0000000000000000 -range 1M -target_address_space [get_bd_addr_spaces abm_and_smem/abm_manager/abm_loader_0/ABM_AXI] [get_bd_addr_segs abm_and_smem/abm_manager/muxed_sdp_ram_if_0/S1_AXI/reg0]
assign_bd_address -offset 0x0000000000000000 -range 16E -target_address_space [get_bd_addr_spaces abm_and_smem/abm_manager/abm_loader_0/PCI_AXI] [get_bd_addr_segs pcie_bridge/pcie_bridge_0/S_AXI_B/BAR0]
assign_bd_address -offset 0x0000000000000000 -range 1M -target_address_space [get_bd_addr_spaces abm_and_smem/abm_manager/abm_loader_1/ABM_AXI] [get_bd_addr_segs abm_and_smem/abm_manager/muxed_sdp_ram_if_1/S1_AXI/reg0]
assign_bd_address -offset 0x0000000000000000 -range 16E -target_address_space [get_bd_addr_spaces abm_and_smem/abm_manager/abm_loader_1/PCI_AXI] [get_bd_addr_segs pcie_bridge/pcie_bridge_0/S_AXI_B/BAR0]
assign_bd_address -offset 0x000 -range 4K -target_address_space [get_bd_addr_spaces abm_and_smem/smem_writer/clock_manager/M_AXI] [get_bd_addr_segs abm_and_smem/smem_writer/hs_clock/s_axi_lite/Reg]
assign_bd_address -offset 0x00000 -range 1M -target_address_space [get_bd_addr_spaces abm_and_smem/smem_writer/fetch_abm/M_ABM] [get_bd_addr_segs abm_and_smem/abm_manager/abm_manager_if/S_AXI/reg0]
assign_bd_address -offset 0x00000 -range 1M -target_address_space [get_bd_addr_spaces abm_and_smem/smem_writer/fetch_abm/M_SMC] [get_bd_addr_segs abm_and_smem/smem_writer/cache/smem_cache_ctl/S_AXI/Mem0]
assign_bd_address -offset 0x0000000000000000 -range 1M -target_address_space [get_bd_addr_spaces channel_0/rdmx_recv/M_AXI] [get_bd_addr_segs abm_and_smem/abm_manager/muxed_sdp_ram_if_0/S0_AXI/reg0]
assign_bd_address -offset 0x0000000000000000 -range 1M -target_address_space [get_bd_addr_spaces channel_1/rdmx_recv/M_AXI] [get_bd_addr_segs abm_and_smem/abm_manager/muxed_sdp_ram_if_1/S0_AXI/reg0]
assign_bd_address -offset 0x00000 -range 1M -target_address_space [get_bd_addr_spaces packet_generator/poke/initial_fill/M_AXI] [get_bd_addr_segs packet_generator/BRAM/axi_bram_ctrl/S_AXI/Mem0]
assign_bd_address -offset 0x00000 -range 1M -target_address_space [get_bd_addr_spaces packet_generator/poke/poke/M_AXI] [get_bd_addr_segs packet_generator/BRAM/axi_bram_ctrl/S_AXI/Mem0]
assign_bd_address -offset 0x0000000000000000 -range 1M -target_address_space [get_bd_addr_spaces packet_generator/transmit/abm_sender_0/DST_AXI] [get_bd_addr_segs packet_generator/transmit/rdmx_xmit_0/S_AXI/reg0]
assign_bd_address -offset 0x0000000000000000 -range 1M -target_address_space [get_bd_addr_spaces packet_generator/transmit/abm_sender_0/SRC_AXI] [get_bd_addr_segs packet_generator/BRAM/axi_bram_ctrl/S_AXI/Mem0]
assign_bd_address -offset 0x0000000000000000 -range 1M -target_address_space [get_bd_addr_spaces packet_generator/transmit/abm_sender_1/DST_AXI] [get_bd_addr_segs packet_generator/transmit/rdmx_xmit_1/S_AXI/reg0]
assign_bd_address -offset 0x0000000000000000 -range 1M -target_address_space [get_bd_addr_spaces packet_generator/transmit/abm_sender_1/SRC_AXI] [get_bd_addr_segs packet_generator/BRAM/axi_bram_ctrl/S_AXI/Mem0]
assign_bd_address -offset 0x00000000 -range 512M -target_address_space [get_bd_addr_spaces pcie_bridge/axi4_lite_plug/M_AXI] [get_bd_addr_segs pcie_bridge/pcie_bridge_0/S_AXI_LITE/CTL0]
assign_bd_address -offset 0x0000000000001000 -range 256 -target_address_space [get_bd_addr_spaces pcie_bridge/pcie_bridge_0/M_AXI_B] [get_bd_addr_segs abm_and_smem/abm_and_smem_ctl/S_AXI/reg0]
assign_bd_address -offset 0x0000000000002000 -range 256 -target_address_space [get_bd_addr_spaces pcie_bridge/pcie_bridge_0/M_AXI_B] [get_bd_addr_segs packet_generator/poke/poke_ctl/S_AXI/reg0]
assign_bd_address -offset 0x0000000000003000 -range 256 -target_address_space [get_bd_addr_spaces pcie_bridge/pcie_bridge_0/M_AXI_B] [get_bd_addr_segs packet_generator/transmit/abm_send_ctl/S_AXI/reg0]

validate_bd_design
save_bd_design
